# EAGLE design AeroQuad_v206 (EAGLE 5.07)
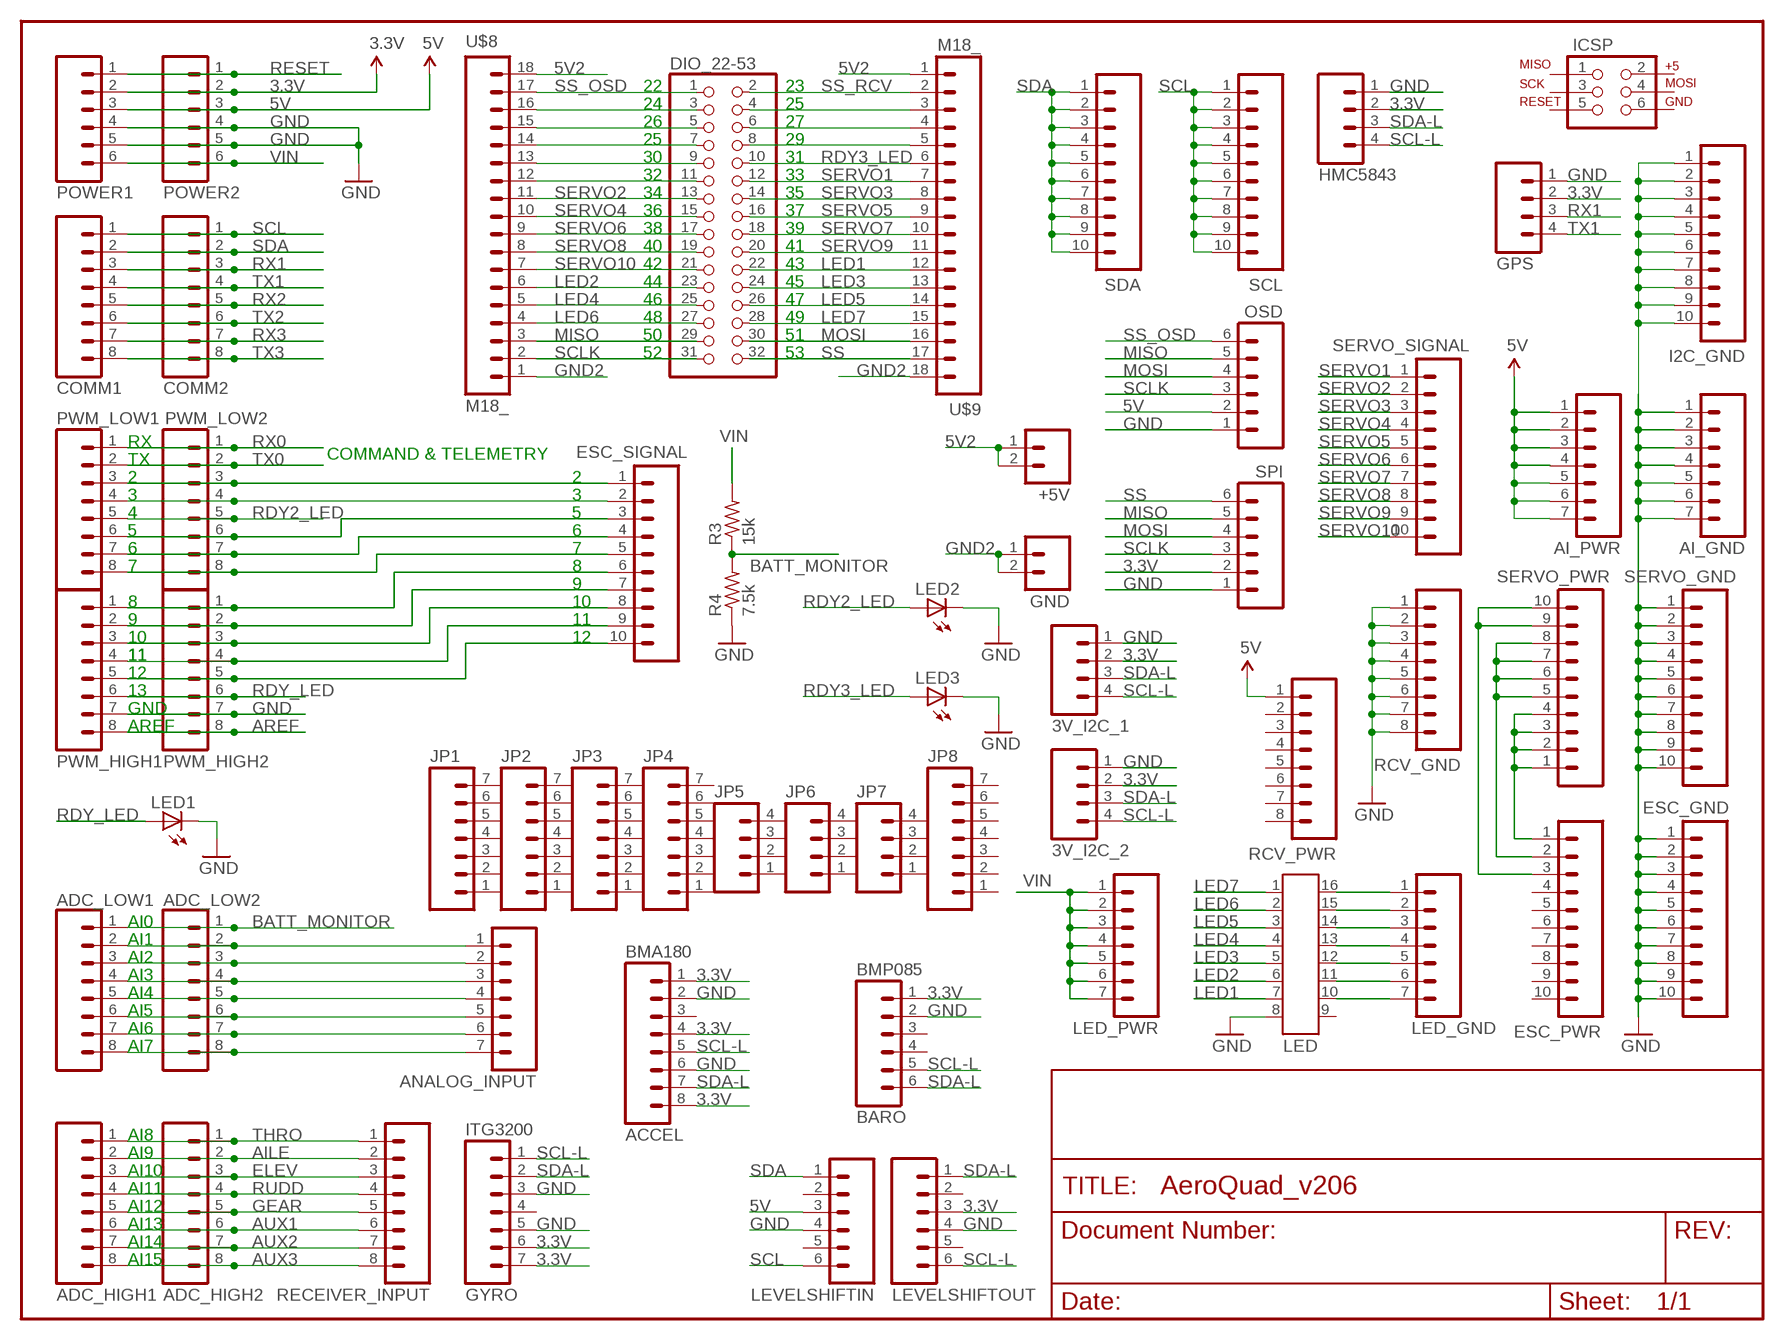
[diagram p0: schematic, sheet 1]

## Parts
3V_I2C_1  M04LOCK  [1X04_LOCK]
3V_I2C_2  M04LOCK  [1X04_LOCK]
+5V  M02PTH  [1X02]
ACCEL  BMA180  M08LOCK  [1X08_LOCK]
ADC_HIGH1  M08LOCK  [1X08_LOCK]
ADC_HIGH2  M08LOCK  [1X08_LOCK]
ADC_LOW1  M08LOCK  [1X08_LOCK]
ADC_LOW2  M08LOCK  [1X08_LOCK]
AI_GND  M07  [1X07]
AI_PWR  M07  [1X07]
ANALOG_INPUT  M07  [1X07]
BARO  BMP085  M06LOCK  [1X06_LOCK]
COMM1  M08LOCK  [1X08_LOCK]
COMM2  M08LOCK  [1X08_LOCK]
DIO_22-53  PINHD-2X16  [2X16]
ESC_GND  M10LOCK  [1X10_LOCK]
ESC_PWR  M10LOCK  [1X10_LOCK]
ESC_SIGNAL  M10LOCK  [1X10_LOCK]
GND  M02PTH  [1X02]
GPS  M04LOCK  [1X04_LOCK]
GYRO  ITG3200  M07LOCK  [1X07_LOCK]
HMC5843  M04LOCK  [1X04_LOCK]
I2C_GND  M10LOCK  [1X10_LOCK]
ICSP  AVR_SPI_PRG_6NS  [2X3-NS]
JP1  M07  [1X07]
JP2  M07  [1X07]
JP3  M07  [1X07]
JP4  M07  [1X07]
JP5  M04PTH  [1X04]
JP6  M04PTH  [1X04]
JP7  M04PTH  [1X04]
JP8  M07  [1X07]
LED  ULN2003A  [DIL16]
LED1  LED5MM  [LED5MM]
LED2  LED5MM  [LED5MM]
LED3  LED5MM  [LED5MM]
LED_GND  M07LOCK  [1X07_LOCK]
LED_PWR  M07LOCK  [1X07_LOCK]
LEVELSHIFTIN  M06LOCK  [1X06_LOCK]
LEVELSHIFTOUT  M06LOCK  [1X06_LOCK]
OSD  M06LOCK  [1X06_LOCK]
POWER1  M06LOCK  [1X06_LOCK]
POWER2  M06LOCK  [1X06_LOCK]
PWM_HIGH1  M08LOCK  [1X08_LOCK]
PWM_HIGH2  M08LOCK  [1X08_LOCK]
PWM_LOW1  M08LOCK  [1X08_LOCK]
PWM_LOW2  M08LOCK  [1X08_LOCK]
R3  15k  R-US_0204/5  [0204/5]
R4  7.5k  R-US_0204/5  [0204/5]
RCV_GND  M10LOCK  M08LOCK  [1X08_LOCK]
RCV_PWR  M10LOCK  M08LOCK  [1X08_LOCK]
RECEIVER_INPUT  M08LOCK  [1X08_LOCK]
SCL  M10LOCK  [1X10_LOCK]
SDA  M10LOCK  [1X10_LOCK]
SERVO_GND  M10LOCK  [1X10_LOCK]
SERVO_PWR  M10LOCK  [1X10_LOCK]
SERVO_SIGNAL  M10LOCK  [1X10_LOCK]
SPI  M06LOCK  [1X06_LOCK]
U$8  M18_  [1X18]
U$9  M18_  [1X18]

## Nets
3.3V: 3V_I2C_1.2 3V_I2C_2.2 ACCEL.1 ACCEL.4 ACCEL.8 BARO.1 GPS.2 GYRO.6 GYRO.7 HMC5843.2 LEVELSHIFTOUT.3 POWER1.2 POWER2.2 SPI.2
5V: AI_PWR.1 AI_PWR.2 AI_PWR.3 AI_PWR.4 AI_PWR.5 AI_PWR.6 AI_PWR.7 LEVELSHIFTIN.3 OSD.2 POWER1.3 POWER2.3 RCV_PWR.1
5V2: +5V.1 +5V.2 U$8.18 U$9.1
AILE: ADC_HIGH1.2 ADC_HIGH2.2 RECEIVER_INPUT.2
AREF: PWM_HIGH1.8 PWM_HIGH2.8
AUX1: ADC_HIGH1.6 ADC_HIGH2.6 RECEIVER_INPUT.6
AUX2: ADC_HIGH1.7 ADC_HIGH2.7 RECEIVER_INPUT.7
AUX3: ADC_HIGH1.8 ADC_HIGH2.8 RECEIVER_INPUT.8
BATT_MONITOR: ADC_LOW1.1 ADC_LOW2.1 R3.1 R4.2
ELEV: ADC_HIGH1.3 ADC_HIGH2.3 RECEIVER_INPUT.3
GEAR: ADC_HIGH1.5 ADC_HIGH2.5 RECEIVER_INPUT.5
GND: 3V_I2C_1.1 3V_I2C_2.1 ACCEL.2 ACCEL.6 AI_GND.1 AI_GND.2 AI_GND.3 AI_GND.4 AI_GND.5 AI_GND.6 AI_GND.7 BARO.2 ESC_GND.1 ESC_GND.2 ESC_GND.3 ESC_GND.4 ESC_GND.5 ESC_GND.6 ESC_GND.7 ESC_GND.8 ESC_GND.9 ESC_GND.10 GPS.1 GYRO.3 GYRO.5 HMC5843.1 I2C_GND.1 I2C_GND.2 I2C_GND.3 I2C_GND.4 I2C_GND.5 I2C_GND.6 I2C_GND.7 I2C_GND.8 I2C_GND.9 I2C_GND.10 LED1.K(C) LED2.K(C) LED3.K(C) LED.8 LEVELSHIFTIN.4 LEVELSHIFTOUT.4 OSD.1 POWER1.4 POWER1.5 POWER2.4 POWER2.5 PWM_HIGH1.7 PWM_HIGH2.7 R4.1 RCV_GND.1 RCV_GND.2 RCV_GND.3 RCV_GND.4 RCV_GND.5 RCV_GND.6 RCV_GND.7 RCV_GND.8 SERVO_GND.1 SERVO_GND.2 SERVO_GND.3 SERVO_GND.4 SERVO_GND.5 SERVO_GND.6 SERVO_GND.7 SERVO_GND.8 SERVO_GND.9 SERVO_GND.10 SPI.1
GND2: GND.1 GND.2 U$8.1 U$9.18
LED1: DIO_22-53.22 LED.7 U$9.12
LED2: DIO_22-53.23 LED.6 U$8.6
LED3: DIO_22-53.24 LED.5 U$9.13
LED4: DIO_22-53.25 LED.4 U$8.5
LED5: DIO_22-53.26 LED.3 U$9.14
LED6: DIO_22-53.27 LED.2 U$8.4
LED7: DIO_22-53.28 LED.1 U$9.15
MISO: DIO_22-53.29 OSD.5 SPI.5 U$8.3
MOSI: DIO_22-53.30 OSD.4 SPI.4 U$9.16
N$1: DIO_22-53.11 U$8.12
N$2: DIO_22-53.9 U$8.13
N$3: DIO_22-53.7 U$8.14
N$4: ADC_LOW1.2 ADC_LOW2.2 ANALOG_INPUT.1
N$5: ESC_SIGNAL.2 PWM_LOW1.4 PWM_LOW2.4
N$6: ADC_LOW1.3 ADC_LOW2.3 ANALOG_INPUT.2
N$7: ADC_LOW1.4 ADC_LOW2.4 ANALOG_INPUT.3
N$8: ADC_LOW1.5 ADC_LOW2.5 ANALOG_INPUT.4
N$9: ADC_LOW1.6 ADC_LOW2.6 ANALOG_INPUT.5
N$10: LED.10 LED_GND.7
N$11: LED.11 LED_GND.6
N$12: LED.12 LED_GND.5
N$13: LED.13 LED_GND.4
N$14: LED.14 LED_GND.3
N$15: DIO_22-53.3 U$8.16
N$16: ESC_SIGNAL.3 PWM_LOW1.6 PWM_LOW2.6
N$17: LED.15 LED_GND.2
N$18: ADC_LOW1.7 ADC_LOW2.7 ANALOG_INPUT.6
N$19: ADC_LOW1.8 ADC_LOW2.8 ANALOG_INPUT.7
N$20: DIO_22-53.5 U$8.15
N$21: ESC_SIGNAL.1 PWM_LOW1.3 PWM_LOW2.3
N$22: DIO_22-53.4 U$9.3
N$23: ESC_SIGNAL.4 PWM_LOW1.7 PWM_LOW2.7
N$24: ESC_SIGNAL.5 PWM_LOW1.8 PWM_LOW2.8
N$25: ESC_SIGNAL.6 PWM_HIGH1.1 PWM_HIGH2.1
N$26: ESC_SIGNAL.7 PWM_HIGH1.2 PWM_HIGH2.2
N$27: ESC_SIGNAL.8 PWM_HIGH1.3 PWM_HIGH2.3
N$28: ESC_SIGNAL.9 PWM_HIGH1.4 PWM_HIGH2.4
N$29: ESC_SIGNAL.10 PWM_HIGH1.5 PWM_HIGH2.5
N$30: ESC_PWR.1 SERVO_PWR.1 SERVO_PWR.2 SERVO_PWR.3 SERVO_PWR.4
N$32: ESC_PWR.2 SERVO_PWR.5 SERVO_PWR.6 SERVO_PWR.7 SERVO_PWR.8
N$33: ESC_PWR.3 SERVO_PWR.9 SERVO_PWR.10
N$37: DIO_22-53.6 U$9.4
N$38: DIO_22-53.8 U$9.5
P$16: LED.16 LED_GND.1
RDY2_LED: LED2.A PWM_LOW1.5 PWM_LOW2.5
RDY3_LED: DIO_22-53.10 LED3.A U$9.6
RDY_LED: LED1.A PWM_HIGH1.6 PWM_HIGH2.6
RESET: POWER1.1 POWER2.1
RUDD: ADC_HIGH1.4 ADC_HIGH2.4 RECEIVER_INPUT.4
RX0: PWM_LOW1.1 PWM_LOW2.1
RX1: COMM1.3 COMM2.3 GPS.3
RX2: COMM1.5 COMM2.5
RX3: COMM1.7 COMM2.7
SCL: COMM1.1 COMM2.1 LEVELSHIFTIN.6 SCL.1 SCL.2 SCL.3 SCL.4 SCL.5 SCL.6 SCL.7 SCL.8 SCL.9 SCL.10
SCL-L: 3V_I2C_1.4 3V_I2C_2.4 ACCEL.5 BARO.5 GYRO.1 HMC5843.4 LEVELSHIFTOUT.6
SCLK: DIO_22-53.31 OSD.3 SPI.3 U$8.2
SDA: COMM1.2 COMM2.2 LEVELSHIFTIN.1 SDA.1 SDA.2 SDA.3 SDA.4 SDA.5 SDA.6 SDA.7 SDA.8 SDA.9 SDA.10
SDA-L: 3V_I2C_1.3 3V_I2C_2.3 ACCEL.7 BARO.6 GYRO.2 HMC5843.3 LEVELSHIFTOUT.1
SERVO1: DIO_22-53.12 SERVO_SIGNAL.1 U$9.7
SERVO2: DIO_22-53.13 SERVO_SIGNAL.2 U$8.11
SERVO3: DIO_22-53.14 SERVO_SIGNAL.3 U$9.8
SERVO4: DIO_22-53.15 SERVO_SIGNAL.4 U$8.10
SERVO5: DIO_22-53.16 SERVO_SIGNAL.5 U$9.9
SERVO6: DIO_22-53.17 SERVO_SIGNAL.6 U$8.9
SERVO7: DIO_22-53.18 SERVO_SIGNAL.7 U$9.10
SERVO8: DIO_22-53.19 SERVO_SIGNAL.8 U$8.8
SERVO9: DIO_22-53.20 SERVO_SIGNAL.9 U$9.11
SERVO10: DIO_22-53.21 SERVO_SIGNAL.10 U$8.7
SS: DIO_22-53.32 SPI.6 U$9.17
SS_OSD: DIO_22-53.1 OSD.6 U$8.17
SS_RCV: DIO_22-53.2 U$9.2
THRO: ADC_HIGH1.1 ADC_HIGH2.1 RECEIVER_INPUT.1
TX0: PWM_LOW1.2 PWM_LOW2.2
TX1: COMM1.4 COMM2.4 GPS.4
TX2: COMM1.6 COMM2.6
TX3: COMM1.8 COMM2.8
VIN: LED_PWR.1 LED_PWR.2 LED_PWR.3 LED_PWR.4 LED_PWR.5 LED_PWR.6 LED_PWR.7 POWER1.6 POWER2.6 R3.2
Unconnected: ACCEL.3 BARO.3 BARO.4 ESC_PWR.4 ESC_PWR.5 ESC_PWR.6 ESC_PWR.7 ESC_PWR.8 ESC_PWR.9 ESC_PWR.10 GYRO.4 ICSP.1 ICSP.2 ICSP.3 ICSP.4 ICSP.5 ICSP.6 JP1.1 JP1.2 JP1.3 JP1.4 JP1.5 JP1.6 JP1.7 JP2.1 JP2.2 JP2.3 JP2.4 JP2.5 JP2.6 JP2.7 JP3.1 JP3.2 JP3.3 JP3.4 JP3.5 JP3.6 JP3.7 JP4.1 JP4.2 JP4.3 JP4.4 JP4.5 JP4.6 JP4.7 JP5.1 JP5.2 JP5.3 JP5.4 JP6.1 JP6.2 JP6.3 JP6.4 JP7.1 JP7.2 JP7.3 JP7.4 JP8.1 JP8.2 JP8.3 JP8.4 JP8.5 JP8.6 JP8.7 LED.9 LEVELSHIFTIN.2 LEVELSHIFTIN.5 LEVELSHIFTOUT.2 LEVELSHIFTOUT.5 RCV_PWR.2 RCV_PWR.3 RCV_PWR.4 RCV_PWR.5 RCV_PWR.6 RCV_PWR.7 RCV_PWR.8

## Notes on the sheet
- 22 | 23
- 24 | 25
- 26 | 27
- 25 | 29
- 30 | 31
- 32 | 33
- 34 | 35
- 36 | 37
- 38 | 39
- 40 | 41
- 42 | 43
- 44 | 45
- 46 | 47
- 48 | 49
- 50 | 51
- 52 | 53
- RX
- COMMAND & TELEMETRY
- TX
- 2 | 2
- 3 | 3
- 4 | 5
- 5 | 6
- 6 | 7
- 7 | 8
- 9
- 8 | 10
- 9 | 11
- 10 | 12
- 11 | 11
- 12
- 13
- GND
- AREF
- AI0
- AI1
- AI2
- AI3
- AI4
- AI5
- AI6
- AI7
- AI8
- AI9
- AI10
- AI11
- AI12
- AI13
- AI14
- AI15

## Library data of the parts
3V_I2C_1 3V_I2C_2 GPS HMC5843 JP5-JP7 = SparkFun:M04: Header 4 Standard 4-pin 0.1" header. Use with straight break away headers (SKU : PRT-00116), right angle break away headers (PRT-00553), swiss pins (PRT-00743), machine pins (PRT-00117), and female headers (PRT-00115). Molex polarized connector foot print use with SKU : PRT-08231 with associated crimp pins and housings.
+5V GND = SparkFun:M02: Header 2 Standard 2-pin 0.1" header. Use with straight break away headers (SKU : PRT-00116), right angle break away headers (PRT-00553), swiss pins (PRT-00743), machine pins (PRT-00117), and female headers (PRT-00115). Molex polarized connector foot print use with SKU : PRT-08233 with associated crimp pins and housings.
ACCEL ADC_HIGH1 ADC_HIGH2 ADC_LOW1 ADC_LOW2 COMM1 COMM2 PWM_HIGH1 PWM_HIGH2 PWM_LOW1 PWM_LOW2 RCV_GND RCV_PWR RECEIVER_INPUT = SparkFun:M08: Header 8 Standard 8-pin 0.1" header. Use with straight break away headers (SKU : PRT-00116), right angle break away headers (PRT-00553), swiss pins (PRT-00743), machine pins (PRT-00117), and female headers (PRT-00115).
AI_GND AI_PWR ANALOG_INPUT GYRO JP1-JP4 JP8 LED_GND LED_PWR = SparkFun:M07: Header 7 Standard 7-pin 0.1" header. Use with straight break away headers (SKU : PRT-00116), right angle break away headers (PRT-00553), swiss pins (PRT-00743), machine pins (PRT-00117), and female headers (PRT-00115). NOTES ON THE VARIANTS LOCK and LOCK_LONGPADS... This footprint was designed to help hold the alignment of a through-hole component (i.e. 7-pin header) while soldering it into place. You may notice that each hole has been shifted either up or down by 0.005 of an inch from it's more standard position (which is usually a perfectly straight line). This slight alteration caused the pins (the squares in the middle) to touch the edges of the holes. Because they are alternating, it causes a "brace" to hold the header in place. 0.005 has proven to be the perfect amount of "off-center" position when using our standard breakaway headers. Although looks a little odd when you look at the bare footprint, once you have a header in there, the alteration is very hard to notice. Also, if you push a header all the way into place, it is covered up entirely on the bottom side. This idea of altering the position of holes to aid alignment will be further integrated into the Sparkfun Library for other footprints. It can help hold any component with 3 or more connection pins.
BARO LEVELSHIFTIN LEVELSHIFTOUT OSD POWER1 POWER2 SPI = SparkFun:M06: Header 6 Standard 6-pin 0.1" header. Use with straight break away headers (SKU : PRT-00116), right angle break away headers (PRT-00553), swiss pins (PRT-00743), machine pins (PRT-00117), and female headers (PRT-00115). Molex polarized connector foot print use with SKU : PRT-08094 with associated crimp pins and housings. NOTES ON THE VARIANTS LOCK and LOCK_LONGPADS... This footprint was designed to help hold the alignment of a through-hole component (i.e. 6-pin header) while soldering it into place. You may notice that each hole has been shifted either up or down by 0.005 of an inch from it's more standard position (which is a perfectly straight line). This slight alteration caused the pins (the squares in the middle) to touch the edges of the holes. Because they are alternating, it causes a "brace" to hold the component in place. 0.005 has proven to be the perfect amount of "off-center" position when using our standard breakaway headers. Although looks a little odd when you look at the bare footprint, once you have a header in there, the alteration is very hard to notice. Also, if you push a header all the way into place, it is covered up entirely on the bottom side. This idea of altering the position of holes to aid alignment will be further integrated into the Sparkfun Library for other footprints. It can help hold any component with 3 or more connection pins.
DIO_22-53 = pinhead:PINHD-2X16: PIN HEADER
ESC_GND ESC_PWR ESC_SIGNAL I2C_GND SCL SDA SERVO_GND SERVO_PWR SERVO_SIGNAL = SparkFun:M10: Header 10 Standard 10-pin 0.1" header. Use with straight break away headers (SKU : PRT-00116), right angle break away headers (PRT-00553), swiss pins (PRT-00743), machine pins (PRT-00117), and female headers (PRT-00115).
ICSP = SparkFun:AVR_SPI_PRG_6: AVR ISP 6 Pin This is the reduced ISP connector for AVR programming. Common on Arduino. This footprint will take up less PCB space and can be used with a 10-pin to 6-pin adapter such as SKU: BOB-08508
LED = CaranchoEngineering:ULN2003: ULN2003A is a high voltage, high current darlington array each containing seven open collector darlington pairs with common emitters.
LED1-LED3 = SparkFun:LED: LEDs Standard schematic elements and footprints for 5mm, 3mm, 1206, and 0603 sized LEDs. 5mm - Spark Fun Electronics SKU : COM-00529 (and others)
R3 R4 = resistor:R-US_: RESISTOR, American symbol
U$8 U$9 = SparkFun:M18

## Board
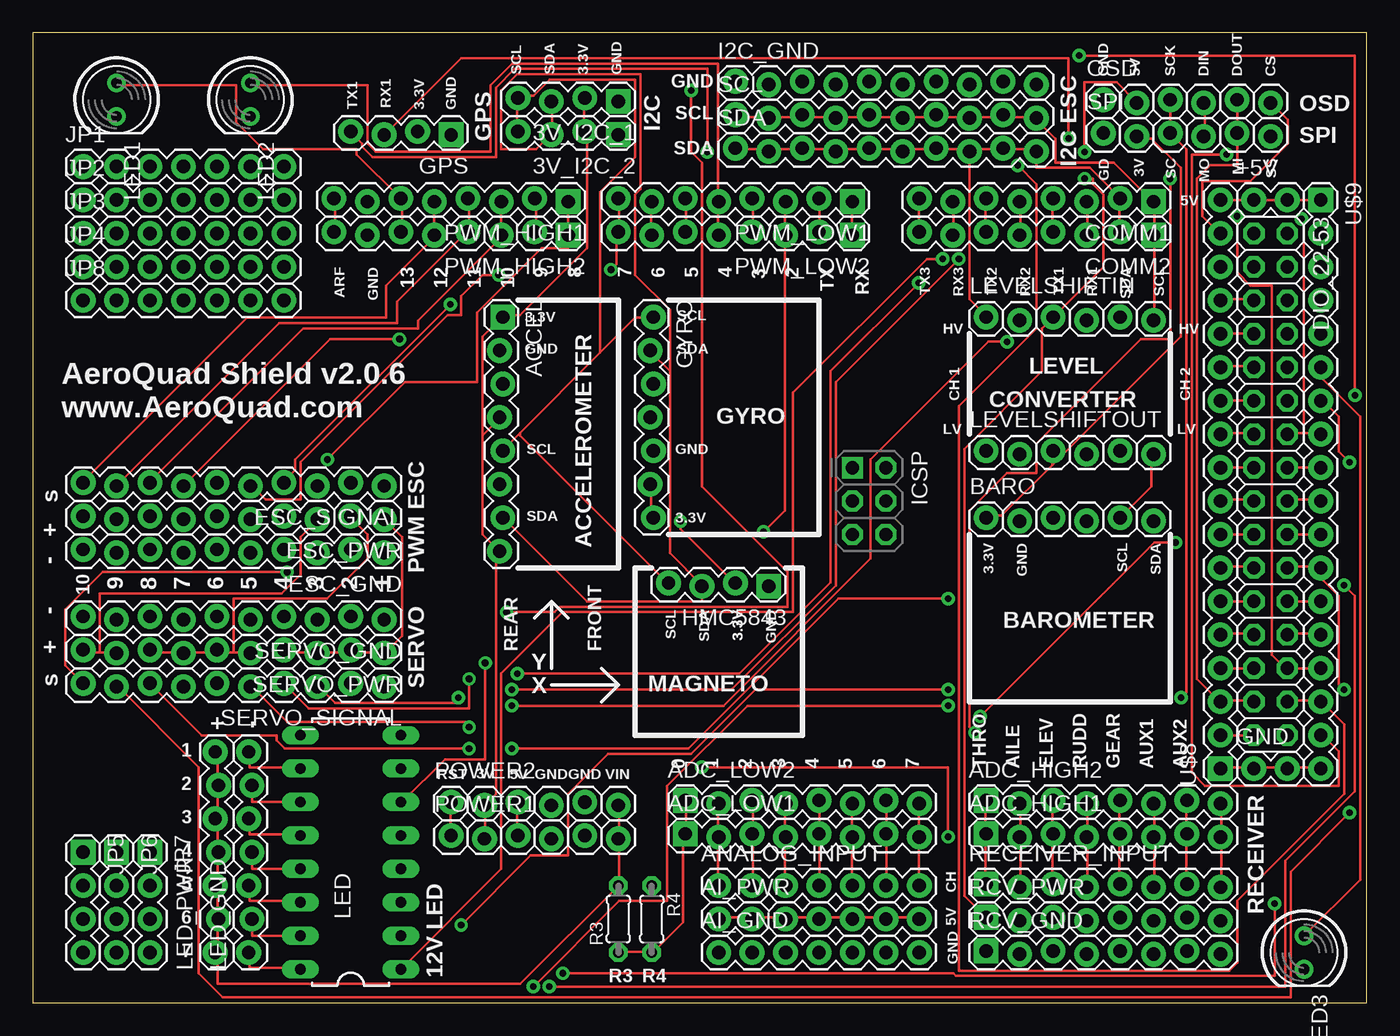
[diagram p1: board, top side]
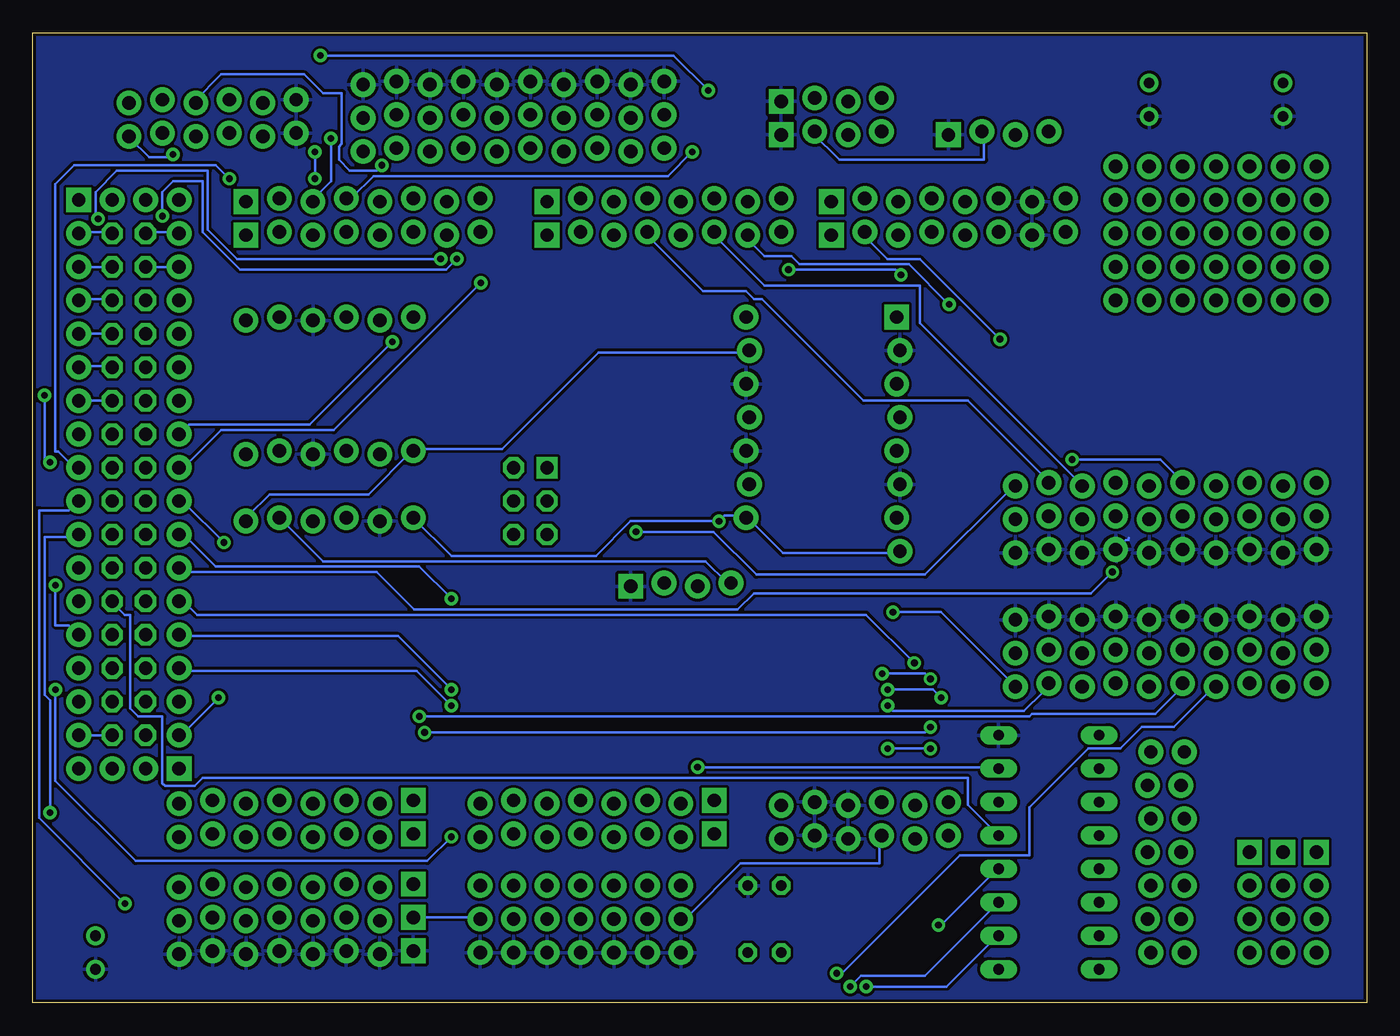
[diagram p2: board, bottom side, seen from below]

Size 101.27 x 73.65 mm. Coordinates in mm from the lower left corner, seen from the top.
Outline: 0,0 101.27,0 101.27,73.65 0,73.65 0,0
Copper layers (1*16): Top 0.035mm / dielectric 1.5mm / Bottom 0.035mm
Design rules "SparkFun": minimum track width 8mil, minimum drill 20mil, track to track 8mil, track to pad 8mil, pad to pad 8mil, via to via 8mil, smd to smd 8mil, copper to edge 10mil, drill to drill 8mil, minimum pad ring 12mil, minimum via ring 10mil, stop-mask expansion 4mil, vias tented up to drill 25mil, thermal gap 10mil

### Footprints (pad centres in the part's own frame; a part is rotated, then mirrored left to right if it is on the bottom)
1X04_LOCK = drill 1.016 pad 1.88 square: 1 0,0.127 | drill 1.016 pad 1.88 round: 2 2.54,-0.127; 3 5.08,0.127; 4 7.62,-0.127
1X02 = drill 1.016 pad 1.88 round: 1 0,0; 2 2.54,0
1X08_LOCK = drill 1.016 pad 1.88 square: 1 0,0.127 | drill 1.016 pad 1.88 round: 2 2.54,-0.127; 3 5.08,0.127; 4 7.62,-0.127; 5 10.16,0.127; 6 12.7,-0.127; 7 15.24,0.127; 8 17.78,-0.127
1X07 = drill 1.016 pad 1.88 round: 1 0,0; 2 2.54,0; 3 5.08,0; 4 7.62,0; 5 10.16,0; 6 12.7,0; 7 15.24,0
1X06_LOCK = drill 1.016 pad 1.88 round: 1 0,0; 2 2.54,-0.254; 3 5.08,0; 4 7.62,-0.254; 5 10.16,0; 6 12.7,-0.254
2X16 = drill 1.016 octagon: 1 -19.05,-1.27; 2 -19.05,1.27; 3 -16.51,-1.27; 4 -16.51,1.27; 5 -13.97,-1.27; 6 -13.97,1.27; 7 -11.43,-1.27; 8 -11.43,1.27; 9 -8.89,-1.27; 10 -8.89,1.27; 11 -6.35,-1.27; 12 -6.35,1.27; 13 -3.81,-1.27; 14 -3.81,1.27; 15 -1.27,-1.27; 16 -1.27,1.27; 17 1.27,-1.27; 18 1.27,1.27; 19 3.81,-1.27; 20 3.81,1.27; 21 6.35,-1.27; 22 6.35,1.27; 23 8.89,-1.27; 24 8.89,1.27; 25 11.43,-1.27; 26 11.43,1.27; 27 13.97,-1.27; 28 13.97,1.27; 29 16.51,-1.27; 30 16.51,1.27; 31 19.05,-1.27; 32 19.05,1.27
1X10_LOCK = drill 1.016 pad 1.88 round: 1 0,0.127; 2 2.54,-0.127; 3 5.08,0.127; 4 7.62,-0.127; 5 10.16,0.127; 6 12.7,-0.127; 7 15.24,0.127; 8 17.78,-0.127; 9 20.32,0.127; 10 22.86,-0.127
1X07_LOCK = drill 1.016 pad 1.88 round: 1 0,0.127; 2 2.54,-0.127; 3 5.08,0.127; 4 7.62,-0.127; 5 10.16,0.127; 6 12.7,-0.127; 7 15.24,0.127
2X3-NS = drill 1.016 square: 1 -2.54,-1.27 | drill 1.016 octagon: 2 -2.54,1.27; 3 0,-1.27; 4 0,1.27; 5 2.54,-1.27; 6 2.54,1.27
1X04 = drill 1.016 pad 1.88 square: 1 0,0 | drill 1.016 pad 1.88 round: 2 2.54,0; 3 5.08,0; 4 7.62,0
DIL16 = drill 0.813 long: 1 -8.89,-3.81; 2 -6.35,-3.81; 3 -3.81,-3.81; 4 -1.27,-3.81; 5 1.27,-3.81; 6 3.81,-3.81; 7 6.35,-3.81; 8 8.89,-3.81; 9 8.89,3.81; 10 6.35,3.81; 11 3.81,3.81; 12 1.27,3.81; 13 -1.27,3.81; 14 -3.81,3.81; 15 -6.35,3.81; 16 -8.89,3.81
LED5MM = drill 0.813 round: A -1.27,0; K 1.27,0
0204/5 = drill 0.813 octagon: 1 -2.54,0; 2 2.54,0
1X18 = drill 1.016 pad 1.88 square: 1 0,0 | drill 1.016 pad 1.88 round: 2 2.54,0; 3 5.08,0; 4 7.62,0; 5 10.16,0; 6 12.7,0; 7 15.24,0; 8 17.78,0; 9 20.32,0; 10 22.86,0; 11 25.4,0; 12 27.94,0; 13 30.48,0; 14 33.02,0; 15 35.56,0; 16 38.1,0; 17 40.64,0; 18 43.18,0

### Placement (x,y rotation side)
3V_I2C_1  44.45,68.58 180 top
3V_I2C_2  44.45,66.04 180 top
+5V  92.71,60.96 0 top
ACCEL  35.56,52.07 270 top
ADC_HIGH1  72.39,12.7 0 top
ADC_HIGH2  72.39,15.24 0 top
ADC_LOW1  49.53,12.7 0 top
ADC_LOW2  49.53,15.24 0 top
AI_GND  52.07,3.81 0 top
AI_PWR  52.07,6.35 0 top
ANALOG_INPUT  52.07,8.89 0 top
BARO  72.39,36.83 0 top
COMM1  85.09,60.96 180 top
COMM2  85.09,58.42 180 top
DIO_22-53  93.98,39.37 270 top
ESC_GND  26.67,34.29 180 top
ESC_PWR  26.67,36.83 180 top
ESC_SIGNAL  26.67,39.37 180 top
GND  92.71,17.78 0 top
GPS  31.75,66.04 180 top
GYRO  46.99,52.07 270 top
HMC5843  55.88,31.75 180 top
I2C_GND  53.34,69.85 0 top
ICSP  63.5,38.1 270 top
JP1  3.81,63.5 0 top
JP2  3.81,60.96 0 top
JP3  3.81,58.42 0 top
JP4  3.81,55.88 0 top
JP5  3.81,11.43 270 top
JP6  6.35,11.43 270 top
JP7  8.89,11.43 270 top
JP8  3.81,53.34 0 top
LED  24.13,11.43 90 top
LED1  6.35,68.58 270 top
LED2  16.51,68.58 270 top
LED3  96.52,3.81 270 top
LED_GND  16.51,3.81 90 top
LED_PWR  13.97,3.81 90 top
LEVELSHIFTIN  72.39,52.07 0 top
LEVELSHIFTOUT  72.39,41.91 0 top
OSD  81.28,68.58 0 top
POWER1  31.75,12.7 0 top
POWER2  31.75,15.24 0 top
PWM_HIGH1  40.64,60.96 180 top
PWM_HIGH2  40.64,58.42 180 top
PWM_LOW1  62.23,60.96 180 top
PWM_LOW2  62.23,58.42 180 top
R3  44.45,6.35 90 top
R4  46.99,6.35 270 top
RCV_GND  72.39,3.81 0 top
RCV_PWR  72.39,6.35 0 top
RECEIVER_INPUT  72.39,8.89 0 top
SCL  53.34,67.31 0 top
SDA  53.34,64.77 0 top
SERVO_GND  26.67,29.21 180 top
SERVO_PWR  26.67,26.67 180 top
SERVO_SIGNAL  26.67,24.13 180 top
SPI  81.28,66.04 0 top
U$8  90.17,17.78 90 top
U$9  97.79,60.96 270 top

### Tracks (layer width: path | path; a pad name or v marks a point on that pad's centre or on a via)
3.3V  (via drill 0.51)
  Top 0.203: 77.42,40.84 73.56,36.98 72.54,36.98 BARO.1 | 77.42,40.84 77.42,41.86 LEVELSHIFTOUT.3 | 77.42,40.84 87.17,50.6 87.17,63.4 84.94,65.63 83.92,65.63 SPI.2 | 3V_I2C_1.2 41.86,68.68 41.86,66.24 3V_I2C_2.2 42.06,66.04 42.06,57.3 36.98,52.22 35.76,52.22 ACCEL.1 35.56,52.02 34.14,50.6 34.14,43.08 | GYRO.7 46.94,36.98 46.94,39.22 GYRO.6 | v49.17,36.58 49.17,35.97 53.24,31.9 HMC5843.2 | POWER1.2 34.34,12.6 34.34,14.83 POWER2.2 35.15,15.85 35.15,34.54 | 35.15,34.54 34.14,35.56 34.14,43.08 | 35.15,34.54 35.36,34.34 ACCEL.8 35.15,34.54 | 34.14,43.08 35.36,44.3 ACCEL.4
  Bottom 0.203: GPS.2 29.06,66.04 29.06,64.01 40.03,64.01 42.06,66.04 3V_I2C_2.2 | ACCEL.8 35.56,34.14 44.3,34.14 46.94,36.78 GYRO.7 47.14,36.98 48.77,36.98 v49.17,36.58 55.88,36.58 58.52,33.93 69.49,33.93 BARO.1
5V  (via drill 0.51)
  Top 0.203: POWER1.3 36.78,12.8 36.78,15.24 POWER2.3 | AI_PWR.1 52.22,6.5 54.46,6.5 AI_PWR.2 54.66,6.5 57.1,6.5 AI_PWR.3 57.3,6.5 59.54,6.5 AI_PWR.4 59.74,6.5 62.18,6.5 AI_PWR.5 62.38,6.5 64.62,6.5 AI_PWR.6 64.82,6.5 67.26,6.5 AI_PWR.7 | RCV_PWR.1 72.34,6.5 70.71,8.13 70.71,42.06 76.61,47.95 76.61,51.21 LEVELSHIFTIN.3 81.28,55.88 81.28,61.37 80.47,62.18 80.47,62.59 v79.86,62.59 | v79.86,64.62 79.86,69.9 82.3,69.9 83.72,68.48 OSD.2
  Bottom 0.203: POWER1.3 36.98,12.6 36.98,10.57 47.55,10.57 51.61,6.5 52.02,6.5 AI_PWR.1 | RCV_PWR.1 72.34,6.5 67.46,6.5 AI_PWR.7 | v79.86,62.59 v79.86,64.62
5V2
  Top 0.203: U$8.18 +5V.1 +5V.2 U$9.1
AILE
  Top 0.203: RECEIVER_INPUT.2 74.98,8.94 74.98,12.39 ADC_HIGH1.2 74.98,12.6 74.98,15.04 ADC_HIGH2.2
AREF
  Top 0.203: PWM_HIGH2.8 22.96,58.73 22.96,60.96 PWM_HIGH1.8
AUX1
  Top 0.203: RECEIVER_INPUT.6 85.14,8.94 85.14,12.39 ADC_HIGH1.6 85.14,12.6 85.14,15.04 ADC_HIGH2.6
AUX2
  Top 0.203: RECEIVER_INPUT.7 87.58,9.14 87.58,12.8 ADC_HIGH1.7 87.58,13.01 87.58,15.24 ADC_HIGH2.7
AUX3
  Top 0.203: RECEIVER_INPUT.8 90.22,8.94 90.22,12.39 ADC_HIGH1.8 90.22,12.6 90.22,15.04 ADC_HIGH2.8
BATT_MONITOR
  Top 0.203: R3.1 44.5,3.86 46.94,3.86 R4.2 47.14,3.86 49.38,6.1 49.38,12.8 ADC_LOW1.1 49.58,13.01 49.58,15.24 ADC_LOW2.1
ELEV
  Top 0.203: RECEIVER_INPUT.3 77.42,9.14 77.42,12.8 ADC_HIGH1.3 77.42,13.01 77.42,15.24 ADC_HIGH2.3
GEAR
  Top 0.203: RECEIVER_INPUT.5 82.5,9.14 82.5,12.8 ADC_HIGH1.5 82.5,13.01 82.5,15.24 ADC_HIGH2.5
GND
  Bottom 0.203: ESC_GND.4 18.9,34.54 18.29,35.15 18.09,35.15 18.04,35.28
  pour Bottom: 0,0 0,73.66 101.6,73.66 101.6,0
GND2
  Top 0.203: U$8.1 90.22,17.88 92.66,17.88 GND.1 92.86,17.88 95.1,17.88 GND.2 95.3,17.88 97.74,17.88 U$9.18
LED1  (via drill 0.51)
  Top 0.203: v50.8,17.88 69.49,17.88 v69.49,12.6 | v99.57,23.77 99.16,24.18 99.16,30.89 97.94,32.11 97.94,32.92 U$9.12 97.74,33.12 95.3,33.12 DIO_22-53.22
  Bottom 0.203: v50.8,17.88 28.04,17.88 LED.7 | v69.49,12.6 71.32,10.77 93.47,10.77 99.57,16.87 v99.57,23.77
LED2  (via drill 0.51)
  Top 0.203: v34.34,25.81 34.34,18.49 31.29,18.49 28.04,15.24 LED.6 | U$8.6 DIO_22-53.23
  Bottom 0.203: v34.34,25.81 38,29.46 88.8,29.46 89.81,30.48 U$8.6
LED3
  Top 0.203: DIO_22-53.24 U$9.13
  Bottom 0.203: LED.5 30.28,15.04 30.28,17.07 88.39,17.07 89,16.46 91.24,16.46 91.44,16.66 91.44,21.74 93.27,21.74 93.88,22.35 93.88,29.46 94.28,29.46 95.3,30.48 DIO_22-53.24
LED4  (via drill 0.51)
  Top 0.203: v32.51,5.89 37.8,11.18 40.64,11.18 40.64,15.85 43.69,18.9 49.99,18.9 54.86,23.77 v69.49,23.77 | DIO_22-53.25 92.66,28.04 90.22,28.04 U$8.5
  Bottom 0.203: v32.51,5.89 32.31,5.89 28.04,10.16 LED.4 | v69.49,23.77 73.56,27.84 90.02,27.84 U$8.5
LED5  (via drill 0.51)
  Top 0.203: v39.22,1.22 95.1,1.22 95.1,10.77 100.38,16.05 100.38,30.89 v99.57,31.7 | DIO_22-53.26 95.3,28.04 97.74,28.04 U$9.14
  Bottom 0.203: v39.22,1.22 38.41,2.03 33.53,2.03 LED.3 | v99.57,31.7 99.57,28.65 98.55,28.65 97.94,28.04 U$9.14
LED6  (via drill 0.51)
  Top 0.203: v38,1.22 44.5,7.72 48.16,7.72 48.16,16.46 54.25,22.55 v69.49,22.55 | U$8.4 DIO_22-53.27
  Bottom 0.203: v38,1.22 31.9,1.22 28.04,5.08 LED.2 | v69.49,22.55 72.14,25.2 89.81,25.2 90.02,25.4 U$8.4
LED7  (via drill 0.51)
  Top 0.203: v69.09,56.49 67.87,56.49 57.71,46.33 57.71,29.67 40.23,29.67 35.56,24.99 35.56,10.16 LED.1 | v91.44,59.74 91.44,55.47 92.46,54.46 94.08,54.46 94.08,26.42 95.1,25.4 DIO_22-53.28 U$9.15
  Bottom 0.203: v69.09,56.49 69.9,55.68 85.55,55.68 88.39,58.52 88.39,62.38 90.63,62.38 91.44,61.57 v91.44,59.74
MISO
  Top 0.203: DIO_22-53.29 92.66,22.96 90.22,22.96 U$8.3 90.02,22.96 88.39,24.59 88.39,62.59 89.41,63.6 91.44,63.6 SPI.5 OSD.5
MOSI  (via drill 0.51)
  Top 0.203: DIO_22-53.30 95.3,22.96 97.74,22.96 U$9.16 97.94,22.76 99.57,21.13 99.57,15.85 91.44,7.72 91.44,3.05 90.83,2.44 70.31,2.44 70.31,45.31 76.2,51.21 76.2,62.18 v74.78,63.6 | SPI.4 89,65.84 89,68.28 OSD.4
  Bottom 0.203: v74.78,63.6 75.18,63.2 77.22,63.2 78.03,64.01 78.03,65.02 77.83,65.23 77.83,69.09 79.25,69.09 80.67,70.51 86.97,70.51 89,68.48 OSD.4
N$1
  Top 0.203: U$8.12 DIO_22-53.11
N$2
  Top 0.203: DIO_22-53.9 92.66,48.36 90.22,48.36 U$8.13
N$3
  Top 0.203: U$8.14 DIO_22-53.7
N$4
  Top 0.203: ANALOG_INPUT.1 52.02,8.94 52.02,12.39 ADC_LOW1.2 52.02,12.6 52.02,15.04 ADC_LOW2.2
N$5
  Top 0.203: PWM_LOW1.4 54.66,60.96 54.66,58.73 PWM_LOW2.4
  Bottom 0.203: ESC_SIGNAL.2 24.18,39.62 30.28,45.72 38.2,45.72 45.92,53.44 46.53,53.44 47.14,54.05 50.39,54.05 54.46,58.12 54.46,58.52 PWM_LOW2.4
N$6
  Top 0.203: ANALOG_INPUT.2 54.66,8.94 54.66,12.8 ADC_LOW1.3 54.66,13.01 54.66,15.24 ADC_LOW2.3
N$7
  Top 0.203: ANALOG_INPUT.3 57.1,8.94 57.1,12.39 ADC_LOW1.4 57.1,12.6 57.1,15.04 ADC_LOW2.4
N$8
  Top 0.203: ANALOG_INPUT.4 59.74,8.94 59.74,12.8 ADC_LOW1.5 59.74,13.01 59.74,15.24 ADC_LOW2.5
N$9
  Top 0.203: ANALOG_INPUT.5 62.18,8.94 62.18,12.39 ADC_LOW1.6 62.18,12.6 62.18,15.04 ADC_LOW2.6
N$10
  Top 0.203: LED.10 20.32,17.88 16.46,17.88 16.46,18.9 LED_GND.7
N$11
  Top 0.203: LED.11 16.66,15.24 16.66,16.46 LED_GND.6
N$12
  Top 0.203: LED.12 20.32,12.8 16.46,12.8 16.46,13.82 LED_GND.5
N$13
  Top 0.203: LED.13 16.66,10.16 16.66,11.38 LED_GND.4
N$14
  Top 0.203: LED.14 20.32,7.72 16.46,7.72 16.46,8.74 LED_GND.3
N$15
  Bottom 0.203: U$8.16 DIO_22-53.3
N$16
  Top 0.203: PWM_LOW1.6 49.58,60.96 49.58,58.73 PWM_LOW2.6
  Bottom 0.203: ESC_SIGNAL.3 21.74,39.42 33.93,51.61 33.93,54.46 45.72,54.46 49.38,58.12 49.38,58.52 PWM_LOW2.6
N$17
  Top 0.203: LED.15 16.66,5.08 16.66,6.3 LED_GND.2
N$18
  Top 0.203: ANALOG_INPUT.6 64.82,8.94 64.82,12.8 ADC_LOW1.7 64.82,13.01 64.82,15.24 ADC_LOW2.7
N$19
  Top 0.203: ANALOG_INPUT.7 67.26,8.94 67.26,12.39 ADC_LOW1.8 67.26,12.6 67.26,15.04 ADC_LOW2.8
N$20
  Top 0.203: DIO_22-53.5 92.66,53.44 90.22,53.44 U$8.15
N$21  (via drill 0.51)
  Top 0.203: v55.47,35.76 57.1,37.39 57.1,58.12 PWM_LOW2.3 57.1,58.32 57.1,60.76 PWM_LOW1.3
  Bottom 0.203: v55.47,35.76 49.58,35.76 46.33,32.51 33.53,32.51 26.82,39.22 ESC_SIGNAL.1
N$22
  Bottom 0.203: DIO_22-53.4 U$9.3
N$23  (via drill 0.51)
  Top 0.203: v31.7,53.03 19.91,41.25 19.91,40.44 19.1,39.62 ESC_SIGNAL.4 | PWM_LOW1.7 46.94,60.76 46.94,58.32 PWM_LOW2.7
  Bottom 0.203: v31.7,53.03 34.75,56.08 43.08,56.08 43.69,56.69 45.72,56.69 47.14,58.12 PWM_LOW2.7
N$24  (via drill 0.51)
  Top 0.203: v35.36,55.27 34.14,55.27 32.51,53.65 32.51,52.22 31.5,52.22 20.32,41.05 20.32,38.2 17.68,38.2 16.66,39.22 ESC_SIGNAL.5 | v43.89,55.68 44.3,56.08 44.3,58.52 PWM_LOW2.8 44.5,58.73 44.5,60.96 PWM_LOW1.8
  Bottom 0.203: v35.36,55.27 35.76,55.68 v43.89,55.68
N$25  (via drill 0.51)
  Top 0.203: v22.35,41.25 28.25,47.14 33.73,47.14 33.73,52.43 38.61,57.3 40.64,57.3 PWM_HIGH2.1 PWM_HIGH1.1
  Bottom 0.203: v22.35,41.25 15.65,41.25 14.02,39.62 ESC_SIGNAL.6
N$26  (via drill 0.51)
  Top 0.203: v27.84,50.39 22.55,50.39 11.58,39.42 ESC_SIGNAL.7 | PWM_HIGH1.2 38.2,60.96 38.2,58.73 PWM_HIGH2.2
  Bottom 0.203: v27.84,50.39 33.93,56.49 36.37,56.49 38,58.12 38,58.52 PWM_HIGH2.2
N$27
  Top 0.203: ESC_SIGNAL.8 8.94,39.62 20.52,51.21 29.26,51.21 29.26,51.82 35.56,58.12 PWM_HIGH2.3 PWM_HIGH1.3
N$28
  Top 0.203: ESC_SIGNAL.9 6.5,39.42 18.69,51.61 27.64,51.61 27.64,53.24 32.92,58.52 PWM_HIGH2.4 33.12,58.73 33.12,60.96 PWM_HIGH1.4
N$29
  Top 0.203: ESC_SIGNAL.10 3.86,39.62 16.26,52.02 26.82,52.02 26.82,54.46 30.48,58.12 PWM_HIGH2.5 PWM_HIGH1.5
N$30
  Top 0.203: SERVO_PWR.4 19.1,26.62 21.54,26.62 SERVO_PWR.3 21.74,26.62 23.98,26.62 SERVO_PWR.2 24.18,26.62 26.62,26.62 SERVO_PWR.1 26.82,26.62 28.04,27.84 28.04,35.36 26.82,36.58 ESC_PWR.1
N$32
  Top 0.203: 15.24,26.62 14.02,26.62 SERVO_PWR.6 13.82,26.62 11.58,26.62 SERVO_PWR.7 11.38,26.62 8.94,26.62 SERVO_PWR.8 | 15.24,26.62 16.46,26.62 SERVO_PWR.5 | 15.24,26.62 15.24,30.68 22.35,30.68 25.4,33.73 25.4,35.56 24.18,36.78 ESC_PWR.2
N$33
  Top 0.203: 5.08,26.62 6.3,26.62 SERVO_PWR.9 | 5.08,26.62 3.86,26.62 SERVO_PWR.10 | 5.08,26.62 5.08,31.09 18.9,31.09 20.32,32.51 20.32,35.36 21.54,36.58 ESC_PWR.3
N$37
  Bottom 0.203: DIO_22-53.6 95.3,53.44 97.74,53.44 U$9.4
N$38
  Bottom 0.203: DIO_22-53.8 U$9.5
P$16
  Top 0.203: LED.16 20.32,2.64 16.46,2.64 16.46,3.66 LED_GND.1
RDY2_LED
  Top 0.203: LED2.A 16.66,69.7 25.4,69.7 25.4,65.23 26.01,64.62 34.75,64.62 34.75,69.7 36.37,71.32 52.02,71.32 52.02,60.96 PWM_LOW1.5 52.02,60.76 52.02,58.32 PWM_LOW2.5
RDY3_LED
  Top 0.203: LED3.A 100.79,9.35 100.79,44.5 97.94,47.35 97.94,48.16 U$9.6
  Bottom 0.203: DIO_22-53.10 95.3,48.36 97.74,48.36 U$9.6
RDY_LED
  Top 0.203: LED1.A 6.5,69.7 15.44,69.7 15.44,66.85 17.48,64.82 24.59,64.82 24.59,64.41 27.84,61.16 PWM_HIGH1.6 28.04,60.96 28.04,58.73 PWM_HIGH2.6
RESET
  Top 0.203: POWER1.1 31.7,12.8 31.7,15.24 POWER2.1
RUDD
  Top 0.203: RECEIVER_INPUT.4 80.06,8.94 80.06,12.39 ADC_HIGH1.4 80.06,12.6 80.06,15.04 ADC_HIGH2.4
RX0
  Top 0.203: PWM_LOW2.1 62.18,58.32 62.18,60.76 PWM_LOW1.1
RX1  (via drill 0.51)
  Top 0.203: COMM2.3 80.06,58.32 80.06,60.76 COMM1.3 | v78.64,65.63 78.64,71.73 32.51,71.73 26.82,66.04 GPS.3
  Bottom 0.203: v78.64,65.63 78.64,62.38 80.06,60.96 COMM1.3
RX2
  Top 0.203: COMM2.5 74.98,58.32 74.98,60.76 COMM1.5
RX3
  Top 0.203: COMM2.7 69.9,58.32 69.9,60.76 COMM1.7
SCL
  Top 0.203: LEVELSHIFTIN.6 85.14,51.82 85.14,58.12 COMM2.1 85.14,58.32 85.14,60.76 COMM1.1 84.94,60.96 82.09,63.8 77.62,63.8 77.62,65.63 76.2,67.06 SCL.10 76.2,67.26 73.76,67.26 SCL.9 73.56,67.26 71.12,67.26 | 55.88,67.26 53.44,67.26 SCL.1 | 60.96,67.26 58.52,67.26 SCL.3 58.32,67.26 55.88,67.26 | 55.88,67.26 SCL.2 | 66.04,67.26 63.6,67.26 SCL.5 63.4,67.26 60.96,67.26 | 71.12,67.26 68.68,67.26 SCL.7 68.48,67.26 66.04,67.26 | 66.04,67.26 SCL.6 | 71.12,67.26 SCL.8 | 60.96,67.26 SCL.4
SCL-L
  Top 0.203: BARO.5 84.94,39.22 84.94,41.66 LEVELSHIFTOUT.6 | 3V_I2C_2.4 36.78,66.24 36.78,68.68 3V_I2C_1.4 36.98,68.89 38,68.89 39.22,70.1 45.72,70.1 45.72,64.21 43.08,61.57 43.08,49.38 | 43.08,49.38 45.72,52.02 46.94,52.02 GYRO.1 | 36.98,43.28 43.08,49.38 | 36.98,43.28 35.76,42.06 ACCEL.5 | 36.98,43.28 36.98,43.08 48.16,31.9 HMC5843.4
  Bottom 0.203: BARO.5 79.25,33.53 50.19,33.53 48.56,31.9 48.36,31.9 HMC5843.4
SCLK  (via drill 0.51)
  Top 0.203: U$8.2 DIO_22-53.31 | OSD.3 SPI.3 87.58,64.82 87.58,23.57 v87.17,23.16
  Bottom 0.203: v87.17,23.16 90.02,20.32 U$8.2
SDA
  Top 0.203: COMM2.2 82.5,58.73 82.5,60.96 COMM1.2 82.5,61.16 80.26,63.4 76.2,63.4 SDA.10 76.2,64.82 73.76,64.82 SDA.9 73.56,64.82 71.12,64.82 | 55.88,64.82 53.44,64.82 SDA.1 | 60.96,64.82 58.52,64.82 SDA.3 58.32,64.82 55.88,64.82 | 55.88,64.82 SDA.2 | 66.04,64.82 63.6,64.82 SDA.5 63.4,64.82 60.96,64.82 | 71.12,64.82 68.68,64.82 SDA.7 68.48,64.82 66.04,64.82 | LEVELSHIFTIN.1 72.34,52.22 71.12,53.44 SDA.8 71.12,64.82 | 66.04,64.82 SDA.6 | 60.96,64.82 SDA.4
SDA-L
  Top 0.203: 3V_I2C_1.3 39.42,68.28 39.42,66.04 3V_I2C_2.3 39.22,65.84 38.2,64.82 35.56,64.82 35.56,69.29 36.78,70.51 46.13,70.51 46.13,61.77 45.72,61.37 45.72,55.27 48.36,52.63 48.36,47.95 | ACCEL.7 35.76,36.78 42.06,30.48 50.8,30.48 HMC5843.3 50.8,31.7 48.36,34.14 48.36,47.95 | 48.36,47.95 46.94,49.38 GYRO.2
  Bottom 0.203: BARO.6 84.94,36.58 84.94,36.98 83.31,38.61 75.79,38.61 72.54,41.86 LEVELSHIFTOUT.1 72.34,42.06 65.63,42.06 58.32,49.38 46.94,49.38 GYRO.2
SERVO1  (via drill 0.51)
  Top 0.203: v35.97,29.67 39.62,29.67 40.03,30.07 57.3,30.07 57.3,32.72 50.8,39.22 50.8,63.8 49.99,64.62 v49.99,69.29 | v79.45,71.93 100.38,71.93 v100.38,46.13 | v99.97,41.05 99.16,41.86 99.16,44.5 97.94,45.72 U$9.7
  Bottom 0.203: U$9.7 DIO_22-53.12 | v35.97,29.67 32.31,29.67 26.82,24.18 SERVO_SIGNAL.1 | v49.99,69.29 52.63,71.93 v79.45,71.93 | v100.38,46.13 100.38,41.05 v99.97,41.05
SERVO2  (via drill 0.51)
  Top 0.203: DIO_22-53.13 92.66,43.28 90.22,43.28 U$8.11 | v36.37,22.55 52.43,22.55 63.6,33.73 63.6,41.25 72.54,50.19 v73.97,50.19
  Bottom 0.203: v36.37,22.55 35.97,22.15 26.01,22.15 24.59,23.57 24.18,23.57 24.18,24.18 SERVO_SIGNAL.2 | v73.97,50.19 80.26,43.89 89.41,43.89 90.02,43.28 U$8.11
SERVO3  (via drill 0.51)
  Top 0.203: 96.52,43.28 97.74,43.28 U$9.8 | 96.52,43.28 95.3,43.28 DIO_22-53.14 | v32.31,23.16 32.31,22.76 22.96,22.76 21.74,23.98 SERVO_SIGNAL.3 | v36.37,23.77 53.03,23.77 60.96,31.7 60.96,47.14 v70.31,56.49 | v96.32,59.54 96.52,59.33 96.52,43.28
  Bottom 0.203: v32.31,23.16 32.92,23.77 v36.37,23.77 | v70.31,56.49 85.75,56.49 87.99,58.73 87.99,63.2 94.89,63.2 96.52,61.57 96.52,59.54 v96.32,59.54
SERVO4  (via drill 0.51)
  Top 0.203: U$8.10 DIO_22-53.15 | v33.12,24.59 33.12,22.35 20.93,22.35 19.1,24.18 SERVO_SIGNAL.4 | v36.78,24.99 53.65,24.99 60.55,31.9 60.55,47.95 v67.26,54.66
  Bottom 0.203: v33.12,24.59 33.53,24.99 v36.78,24.99 | v67.26,54.66 78.44,43.48 86.97,43.48 89.81,40.64 U$8.10
SERVO5  (via drill 0.51)
  Top 0.203: U$9.9 DIO_22-53.16 | v33.12,20.93 33.12,21.34 19.3,21.34 16.66,23.98 SERVO_SIGNAL.5 | v71.53,20.52 71.12,20.93 71.12,37.39 73.97,40.23 76.2,40.23 76.2,42.47 84.12,50.39 86.36,50.39 v86.36,62.59
  Bottom 0.203: v33.12,20.93 33.53,20.52 v71.53,20.52 | v86.36,62.59 87.38,63.6 98.15,63.6 99.57,62.18 99.57,41.86 99.36,41.86 98.15,40.64 U$9.9
SERVO6  (via drill 0.51)
  Top 0.203: DIO_22-53.17 92.66,38.2 90.22,38.2 U$8.9 | v71.93,21.74 85.14,34.95 v86.77,34.95
  Bottom 0.203: v71.93,21.74 25.6,21.74 25.4,21.95 16.05,21.95 14.43,23.57 14.02,23.57 14.02,24.18 SERVO_SIGNAL.6 | v86.77,34.95 89.81,38 90.02,38 U$8.9
SERVO7  (via drill 0.51)
  Top 0.203: DIO_22-53.18 95.3,38.2 97.74,38.2 U$9.10 | v40.23,2.23 69.9,2.23 70.1,2.03 94.28,2.03 v94.28,7.52
  Bottom 0.203: v40.23,2.23 39.83,2.23 30.89,11.18 25.6,11.18 25.6,14.83 21.13,19.3 18.69,19.3 17.07,20.93 14.63,20.93 11.58,23.98 SERVO_SIGNAL.7 | v94.28,7.52 100.79,14.02 100.79,37.39 98.55,37.39 97.94,38 U$9.10
SERVO8  (via drill 0.51)
  Top 0.203: U$8.8 DIO_22-53.19 | v33.12,19.3 19.1,19.3 18.49,19.91 18.49,20.32 12.8,20.32 8.94,24.18 SERVO_SIGNAL.8 | v36.37,19.3 49.78,19.3 61.16,30.68 v69.49,30.68
  Bottom 0.203: v33.12,19.3 v36.37,19.3 | v69.49,30.68 71.93,33.12 87.38,33.12 89.81,35.56 U$8.8
SERVO9  (via drill 0.51)
  Top 0.203: U$9.11 DIO_22-53.20 | v99.97,14.43 95.5,9.96 95.5,0.41 14.43,0.41 12.6,2.23 12.6,17.88 6.5,23.98 SERVO_SIGNAL.9
  Bottom 0.203: v99.97,14.43 99.97,22.96 100.38,23.37 100.38,35.36 98.15,35.36 97.94,35.56 U$9.11
SERVO10  (via drill 0.51)
  Top 0.203: DIO_22-53.21 92.66,33.12 90.22,33.12 U$8.7 | v19.3,32.72 5.28,32.72 2.44,29.87 2.44,25.6 3.66,24.38 SERVO_SIGNAL.10
  Bottom 0.203: v19.3,32.72 20.93,31.09 46.53,31.09 47.75,29.87 72.34,29.87 75.18,32.72 89.81,32.72 90.02,32.92 U$8.7
SS  (via drill 0.51)
  Top 0.203: v90.63,64.41 87.99,64.41 87.99,17.48 89,16.46 99.16,16.46 99.16,19.1 97.94,20.32 U$9.17
  Bottom 0.203: U$9.17 DIO_22-53.32 | v90.63,64.41 90.83,64.21 92.46,64.21 93.88,65.63 SPI.6
SS_OSD
  Top 0.203: OSD.6 94.08,68.28 95.3,67.06 95.3,65.23 92.46,62.38 88.8,62.38 88.8,59.74 90.02,58.52 U$8.17
  Bottom 0.203: DIO_22-53.1 92.66,58.52 90.22,58.52 U$8.17
SS_RCV
  Bottom 0.203: DIO_22-53.2 95.3,58.52 97.74,58.52 U$9.2
THRO
  Top 0.203: RECEIVER_INPUT.1 72.34,9.14 72.34,12.8 ADC_HIGH1.1 72.34,13.01 72.34,15.24 ADC_HIGH2.1
TX0
  Top 0.203: PWM_LOW2.2 59.74,58.73 59.74,60.96 PWM_LOW1.2
TX1  (via drill 0.51)
  Top 0.203: COMM2.4 77.42,58.73 77.42,60.96 COMM1.4 | v51.21,64.62 51.21,70.92 36.58,70.92 35.15,69.49 35.15,64.21 25.81,64.21 24.99,65.02 24.99,65.23 24.18,66.04 GPS.4
  Bottom 0.203: v51.21,64.62 53.03,62.79 75.39,62.79 77.01,61.16 77.42,61.16 COMM1.4
TX2
  Top 0.203: COMM2.6 72.34,58.73 72.34,60.96 COMM1.6
TX3
  Top 0.203: COMM2.8 67.26,58.73 67.26,60.96 COMM1.8
VIN
  Top 0.203: POWER2.6 44.5,14.83 44.5,12.6 POWER1.6 44.5,12.39 44.5,8.94 R3.2 36.98,1.42 14.02,1.42 14.02,3.66 LED_PWR.1 14.02,3.86 14.02,6.3 LED_PWR.2 14.02,6.5 14.02,8.74 LED_PWR.3 14.02,8.94 14.02,11.38 LED_PWR.4 14.02,11.58 14.02,13.82 LED_PWR.5 14.02,14.02 14.02,16.46 LED_PWR.6 14.02,16.66 14.02,18.9 LED_PWR.7

### Text on the board
tPlace: SCL | SDA | 3.3V | GND | GND | GND | 5V | SCK | DIN | DOUT | CS | GPS | I2C | TX1 | RX1 | 3.3V | GND | SCL | OSD | SDA | SPI | I2C ESC | GD | 3V | SC | MO | MI | SS | 5V | ARF | GND | 13 | 12 | 11 | 10 | 9 | 8 | 7 | 6 | 5 | 4 | 3 | 2 | TX | RX | TX3 | RX3 | TX2 | RX2 | TX1 | RX1 | SDA | SCL | 3.3V | SCL | ACCELEROMETER | HV | HV | GND | SDA | LEVEL | AeroQuad Shield v2.0.6 | CH 1 | CONVERTER | CH 2 | GYRO | www.AeroQuad.com | LV | LV | SCL | GND | s | SDA | + | 3.3V | 3.3V | GND | SCL | SDA | - | PWM ESC | 10 | 9 | 8 | 7 | 6 | 5 | 4 | 3 | 2 | 1 | - | SCL | SDA | 3.3V | 3.3V | GND | + | BAROMETER | REAR | FRONT | s | Y | MAGNETO | SERVO | X | + | - | 1 | RST | 5V | GND | GND | VIN | 0 | 1 | 2 | 3 | 4 | 5 | 6 | 7 | THRO | AILE | ELEV | RUDD | GEAR | AUX1 | AUX2 | 2 | 3V | 3 | 4 | 5 | CH | 6 | RECEIVER | 5V | 7 | GND | 12V LED | R3 | R4